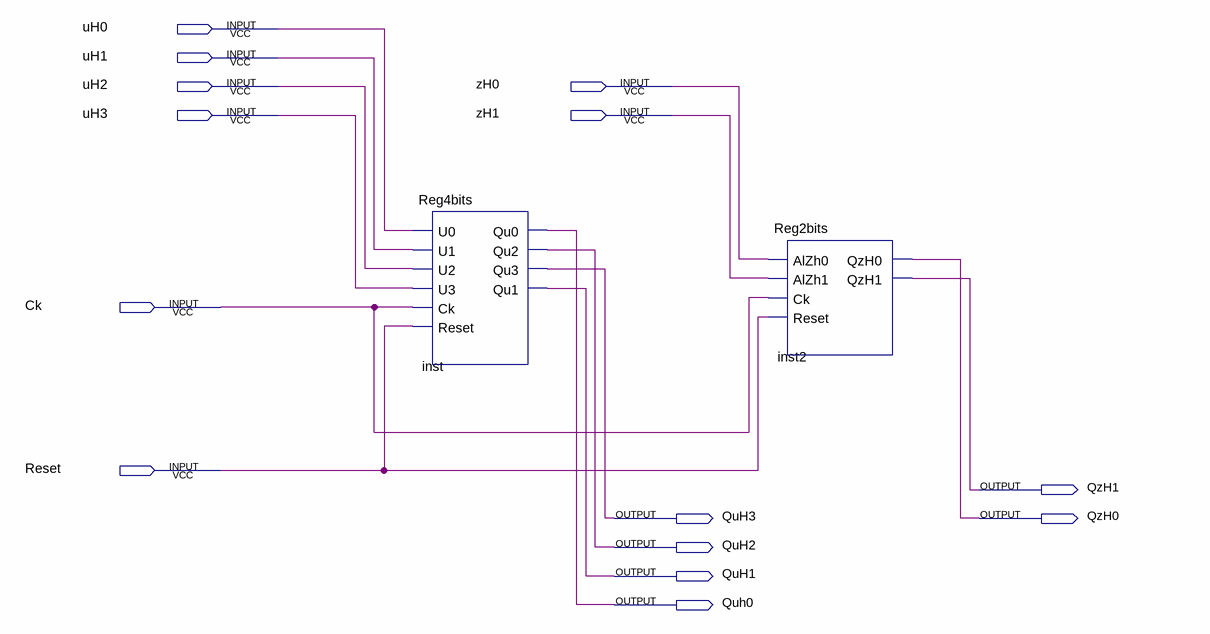
[diagram p0: schematic sheet]
// Quartus schematic RegOre.bdf as structural Verilog: 2 symbols, 14 pins
module RegOre (
  input  uH0,
  input  uH1,
  input  uH2,
  input  zH0,
  input  uH3,
  input  zH1,
  input  Ck,
  input  Reset,
  output QzH1,
  output QuH3,
  output QzH0,
  output QuH2,
  output QuH1,
  output Quh0
);

  Reg4bits inst (
    .U0(uH0), .U1(uH1), .U2(uH2), .U3(uH3), .Ck(Ck), .Reset(Reset), .Qu0(Quh0), .Qu2(QuH2), .Qu3(QuH3),
    .Qu1(QuH1));
  Reg2bits inst2 (.AlZh0(zH0), .AlZh1(zH1), .Ck(Ck), .Reset(Reset), .QzH0(QzH0), .QzH1(QzH1));
endmodule
